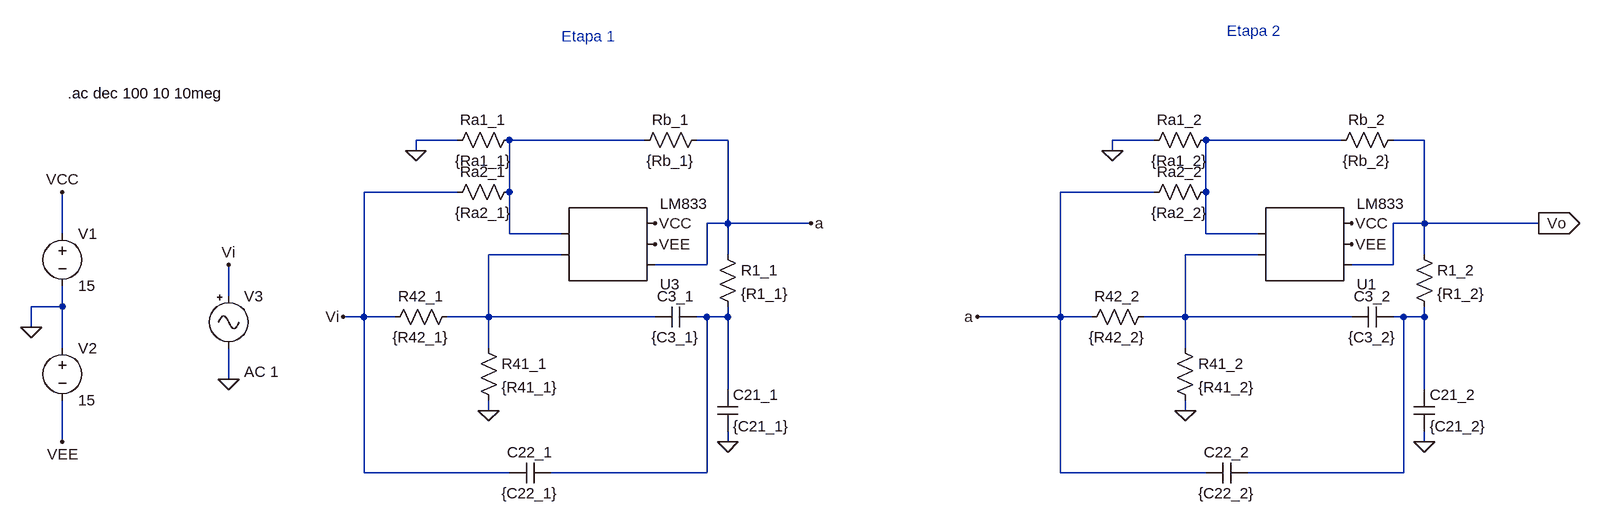
[diagram p0: schematic simulation_template.asc]
simulation_template.asc, the LTspice schematic file:
Version 4
SHEET 1 2824 1088
WIRE 944 144 880 144
WIRE 1232 144 1024 144
WIRE 1360 144 1312 144
WIRE 2016 144 1952 144
WIRE 2304 144 2096 144
WIRE 2432 144 2384 144
WIRE 880 160 880 144
WIRE 1952 160 1952 144
WIRE 944 224 800 224
WIRE 1024 224 1024 144
WIRE 2016 224 1872 224
WIRE 2096 224 2096 144
WIRE 1360 272 1360 144
WIRE 1360 272 1328 272
WIRE 1488 272 1360 272
WIRE 2432 272 2432 144
WIRE 2432 272 2384 272
WIRE 2608 272 2432 272
WIRE 336 288 336 224
WIRE 1024 288 1024 224
WIRE 1104 288 1024 288
WIRE 2096 288 2096 224
WIRE 2176 288 2096 288
WIRE 1104 320 992 320
WIRE 1360 320 1360 272
WIRE 2176 320 2064 320
WIRE 2432 320 2432 272
WIRE 1328 336 1328 272
WIRE 1328 336 1248 336
WIRE 2384 336 2384 272
WIRE 2384 336 2320 336
WIRE 592 384 592 336
WIRE 336 400 336 368
WIRE 336 400 288 400
WIRE 800 416 800 224
WIRE 800 416 768 416
WIRE 848 416 800 416
WIRE 992 416 992 320
WIRE 992 416 928 416
WIRE 1248 416 992 416
WIRE 1328 416 1312 416
WIRE 1360 416 1360 400
WIRE 1360 416 1328 416
WIRE 1872 416 1872 224
WIRE 1872 416 1744 416
WIRE 1920 416 1872 416
WIRE 2064 416 2064 320
WIRE 2064 416 2000 416
WIRE 2320 416 2064 416
WIRE 2400 416 2384 416
WIRE 2432 416 2432 400
WIRE 2432 416 2400 416
WIRE 288 432 288 400
WIRE 336 464 336 400
WIRE 992 464 992 416
WIRE 2064 464 2064 416
WIRE 592 512 592 464
WIRE 1360 528 1360 416
WIRE 2432 528 2432 416
WIRE 992 560 992 544
WIRE 2064 560 2064 544
WIRE 336 608 336 544
WIRE 1360 608 1360 592
WIRE 2432 608 2432 592
WIRE 800 656 800 416
WIRE 1024 656 800 656
WIRE 1328 656 1328 416
WIRE 1328 656 1088 656
WIRE 1872 656 1872 416
WIRE 2096 656 1872 656
WIRE 2400 656 2400 416
WIRE 2400 656 2160 656
FLAG 880 160 0
FLAG 992 560 0
FLAG 1360 608 0
FLAG 288 432 0
FLAG 336 224 VCC
FLAG 336 608 VEE
FLAG 1248 304 VEE
FLAG 1248 272 VCC
FLAG 1952 160 0
FLAG 2064 560 0
FLAG 2432 608 0
FLAG 2608 272 Vo
IOPIN 2608 272 Out
FLAG 2320 304 VEE
FLAG 2320 272 VCC
FLAG 592 512 0
FLAG 592 336 Vi
FLAG 768 416 Vi
FLAG 1488 272 a
FLAG 1744 416 a
SYMBOL res 1040 128 R90
WINDOW 0 0 56 VBottom 2
WINDOW 3 32 56 VTop 2
SYMATTR InstName Ra1_1
SYMATTR Value {Ra1_1}
SYMBOL res 1040 208 R90
WINDOW 0 0 56 VBottom 2
WINDOW 3 32 56 VTop 2
SYMATTR InstName Ra2_1
SYMATTR Value {Ra2_1}
SYMBOL res 976 448 R0
SYMATTR InstName R41_1
SYMATTR Value {R41_1}
SYMBOL res 944 400 R90
WINDOW 0 0 56 VBottom 2
WINDOW 3 32 56 VTop 2
SYMATTR InstName R42_1
SYMATTR Value {R42_1}
SYMBOL cap 1312 400 R90
WINDOW 0 0 32 VBottom 2
WINDOW 3 32 32 VTop 2
SYMATTR InstName C3_1
SYMATTR Value {C3_1}
SYMBOL cap 1088 640 R90
WINDOW 0 0 32 VBottom 2
WINDOW 3 32 32 VTop 2
SYMATTR InstName C22_1
SYMATTR Value {C22_1}
SYMBOL res 1344 304 R0
SYMATTR InstName R1_1
SYMATTR Value {R1_1}
SYMBOL cap 1344 528 R0
SYMATTR InstName C21_1
SYMATTR Value {C21_1}
SYMBOL res 1328 128 R90
WINDOW 0 0 56 VBottom 2
WINDOW 3 32 56 VTop 2
SYMATTR InstName Rb_1
SYMATTR Value {Rb_1}
SYMBOL voltage 336 272 R0
WINDOW 123 0 0 Left 2
WINDOW 39 0 0 Left 2
SYMATTR InstName V1
SYMATTR Value 15
SYMBOL voltage 336 448 R0
WINDOW 123 0 0 Left 2
WINDOW 39 0 0 Left 2
SYMATTR InstName V2
SYMATTR Value 15
SYMBOL res 2112 128 R90
WINDOW 0 0 56 VBottom 2
WINDOW 3 32 56 VTop 2
SYMATTR InstName Ra1_2
SYMATTR Value {Ra1_2}
SYMBOL res 2112 208 R90
WINDOW 0 0 56 VBottom 2
WINDOW 3 32 56 VTop 2
SYMATTR InstName Ra2_2
SYMATTR Value {Ra2_2}
SYMBOL res 2048 448 R0
SYMATTR InstName R41_2
SYMATTR Value {R41_2}
SYMBOL res 2016 400 R90
WINDOW 0 0 56 VBottom 2
WINDOW 3 32 56 VTop 2
SYMATTR InstName R42_2
SYMATTR Value {R42_2}
SYMBOL cap 2384 400 R90
WINDOW 0 0 32 VBottom 2
WINDOW 3 32 32 VTop 2
SYMATTR InstName C3_2
SYMATTR Value {C3_2}
SYMBOL cap 2160 640 R90
WINDOW 0 0 32 VBottom 2
WINDOW 3 32 32 VTop 2
SYMATTR InstName C22_2
SYMATTR Value {C22_2}
SYMBOL res 2416 304 R0
SYMATTR InstName R1_2
SYMATTR Value {R1_2}
SYMBOL cap 2416 528 R0
SYMATTR InstName C21_2
SYMATTR Value {C21_2}
SYMBOL res 2400 128 R90
WINDOW 0 0 56 VBottom 2
WINDOW 3 32 56 VTop 2
SYMATTR InstName Rb_2
SYMATTR Value {Rb_2}
SYMBOL signal 592 368 R0
WINDOW 123 24 132 Left 2
WINDOW 39 0 0 Left 2
SYMATTR Value2 AC 1
SYMATTR InstName V3
SYMATTR Value ""
SYMBOL AutoGenerated\\LM833 1168 304 M180
SYMATTR InstName U3
SYMBOL AutoGenerated\\LM833 2240 304 M180
SYMATTR InstName U1
TEXT 1104 -16 Left 2 ;Etapa 1
TEXT 2128 -24 Left 2 ;Etapa 2
TEXT 344 72 Left 2 !.ac dec 100 10 10meg

The netlist it stands for:
* simulation_template.asc
Ra1_1 N001 0 {Ra1_1}
Ra2_1 N001 Vi {Ra2_1}
R41_1 N003 0 {R41_1}
R42_1 N003 Vi {R42_1}
C3_1 N005 N003 {C3_1}
C22_1 N005 Vi {C22_1}
R1_1 a N005 {R1_1}
C21_1 N005 0 {C21_1}
Rb_1 a N001 {Rb_1}
V1 VCC 0 15
V2 0 VEE 15
Ra1_2 N002 0 {Ra1_2}
Ra2_2 N002 a {Ra2_2}
R41_2 N004 0 {R41_2}
R42_2 N004 a {R42_2}
C3_2 N006 N004 {C3_2}
C22_2 N006 a {C22_2}
R1_2 Vo N006 {R1_2}
C21_2 N006 0 {C21_2}
Rb_2 Vo N002 {Rb_2}
V3 Vi 0 AC 1
* U3: LM833 (symbol AutoGenerated\LM833 not available, pins judged from their places): pin1=N003 pin2=N001 pin3=a pin4=VEE pin5=VCC
* U1: LM833 (symbol AutoGenerated\LM833 not available, pins judged from their places): pin1=N004 pin2=N002 pin3=Vo pin4=VEE pin5=VCC
* Etapa 1
* Etapa 2
.ac dec 100 10 10meg
.backanno
.end